# EAGLE design esp8266 lua test (EAGLE 8.5.1)
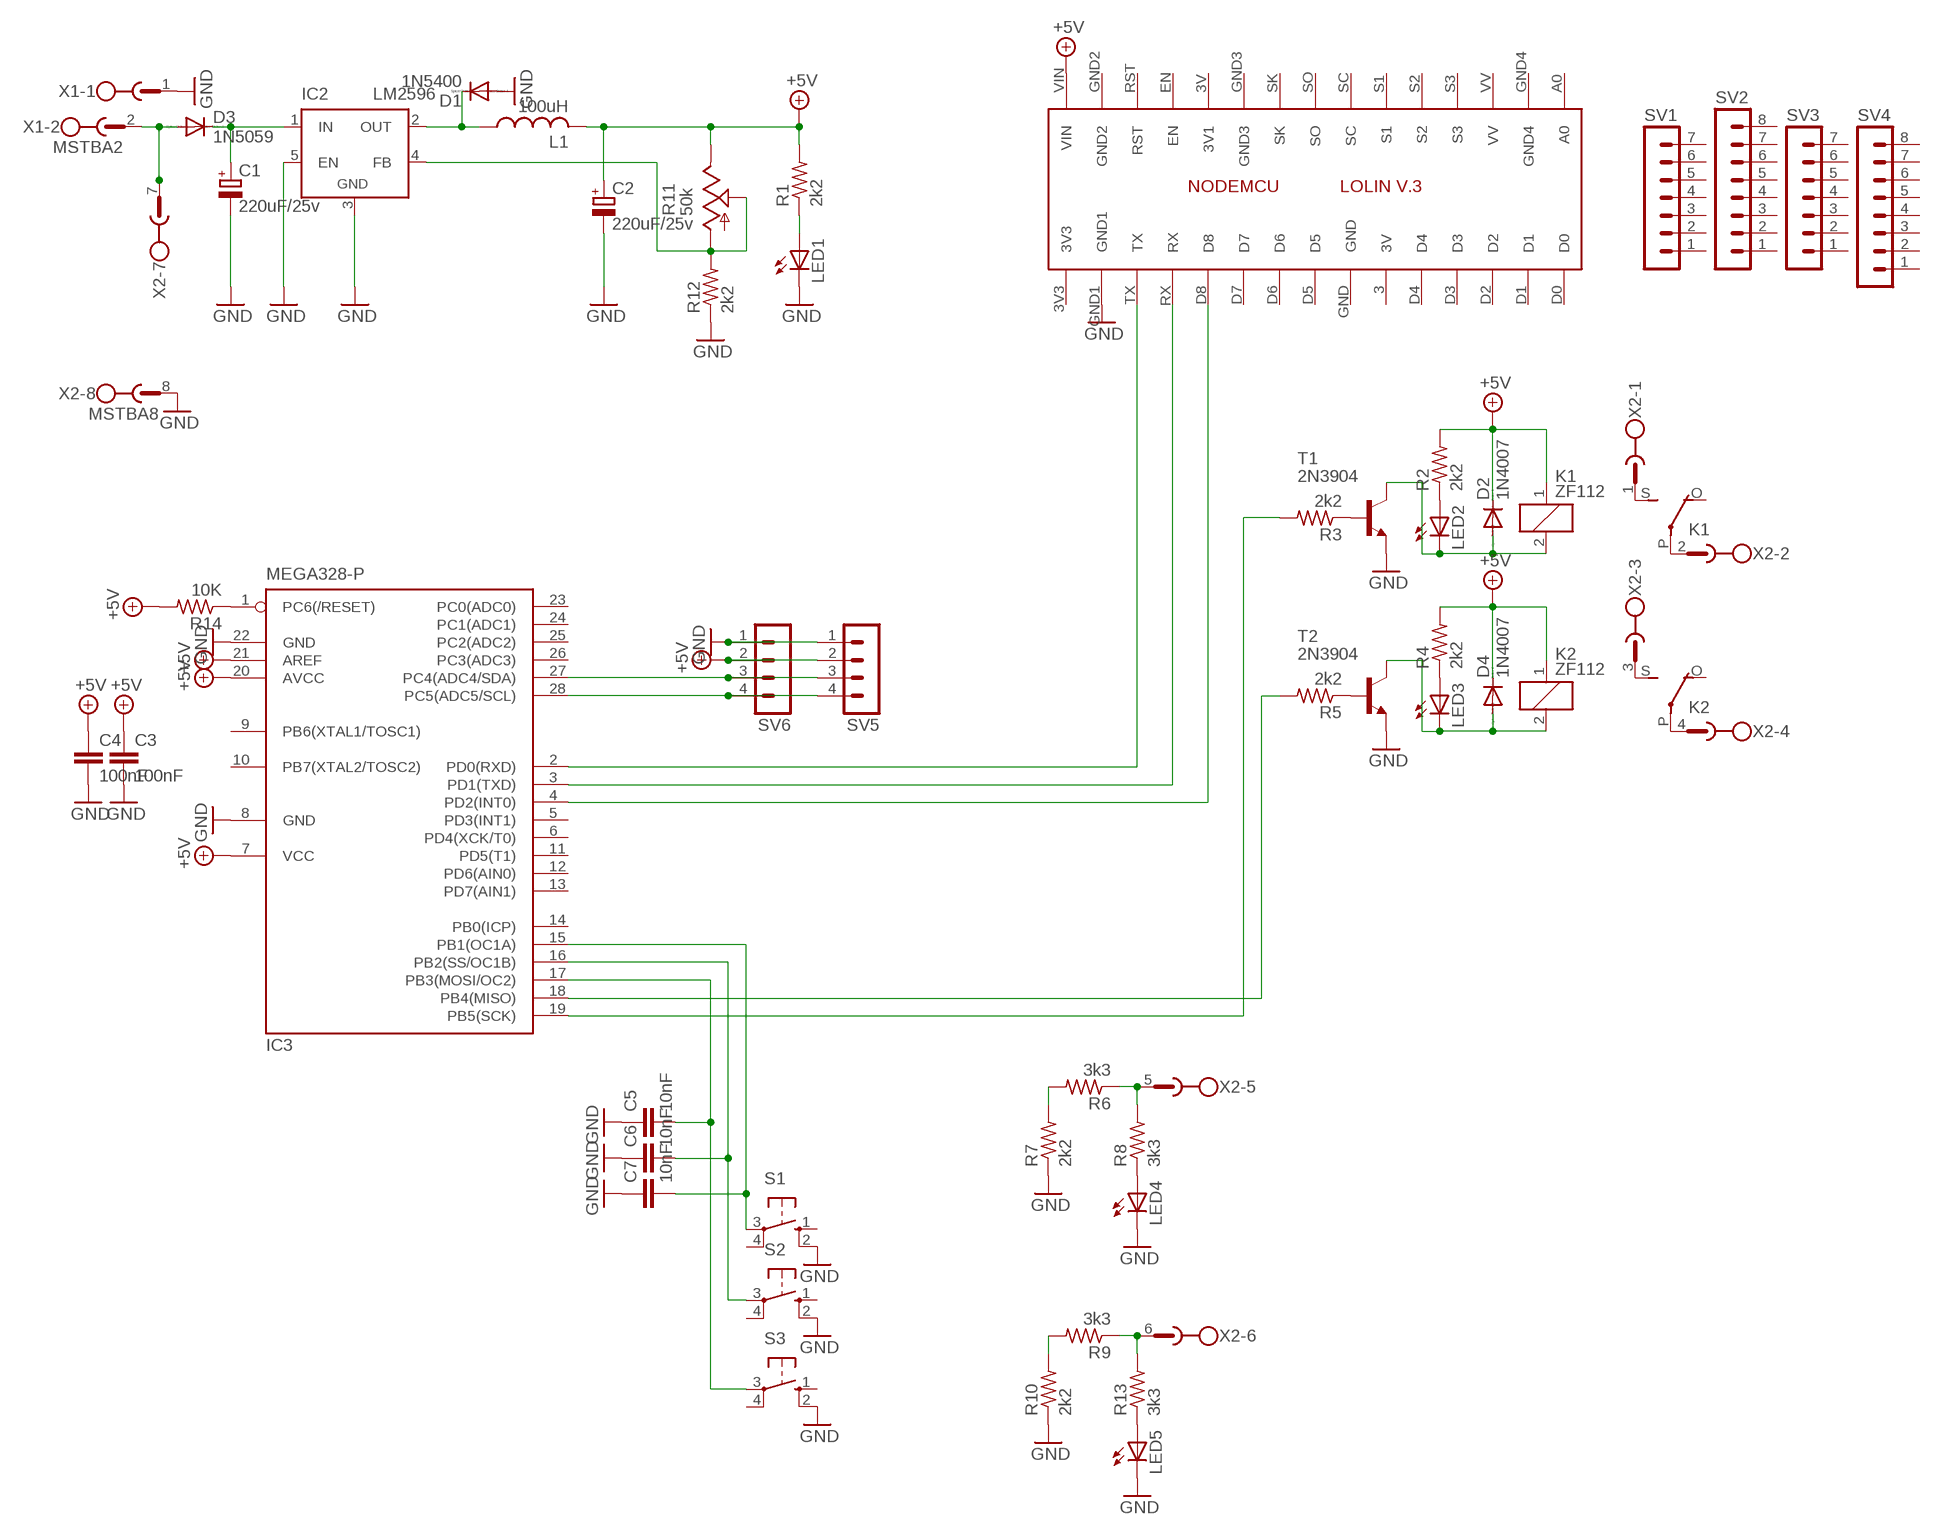
[diagram p0: schematic, sheet 1]

## Parts
C1  220uF/25v  CPOL-EUE3.5-10  [E3,5-10]
C2  220uF/25v  CPOL-EUE3.5-10  [E3,5-10]
C3  100nF  C-EU050-024X044  [C050-024X044]
C4  100nF  C-EU050-024X044  [C050-024X044]
C5  10nF  C-EU050-024X044  [C050-024X044]
C6  10nF  C-EU050-024X044  [C050-024X044]
C7  10nF  C-EU050-024X044  [C050-024X044]
D1  1N5400  [DO201-15]
D2  1N4007  1N4148DO35-7  [DO35-7]
D3  1N5059  [DO204-10]
D4  1N4007  1N4148DO35-7  [DO35-7]
IC1  LOLINV3  [LOLINV3]
IC2  LM2596  LM2596TV  [TO220-51]
IC3  MEGA328-P  MEGA8-P  [DIL28-3]
K1  ZF112  [ZF112]
K2  ZF112  [ZF112]
L1  100uH  L-US6000-XXX-RC  [6000-XXXX-RC]
LED1  LED3MM  [LED3MM]
LED2  LED3MM  [LED3MM]
LED3  LED3MM  [LED3MM]
LED4  LED3MM  [LED3MM]
LED5  LED3MM  [LED3MM]
R1  2k2  R-US_0207/10  [0207/10]
R2  2k2  R-US_0207/10  [0207/10]
R3  2k2  R-US_0207/10  [0207/10]
R4  2k2  R-US_0207/10  [0207/10]
R5  2k2  R-US_0207/10  [0207/10]
R6  3k3  R-US_0207/10  [0207/10]
R7  2k2  R-US_0207/10  [0207/10]
R8  3k3  R-US_0207/10  [0207/10]
R9  3k3  R-US_0207/10  [0207/10]
R10  2k2  R-US_0207/10  [0207/10]
R11  50k  TRIM_US-B25P  [B25P]
R12  2k2  R-US_0207/10  [0207/10]
R13  3k3  R-US_0207/10  [0207/10]
R14  10K  R-US_0207/10  [0207/10]
S1  10-XX  [B3F-10XX]
S2  10-XX  [B3F-10XX]
S3  10-XX  [B3F-10XX]
SV1  MA07-1  [MA07-1]
SV2  MA08-1  [MA08-1]
SV3  MA07-1  [MA07-1]
SV4  MA08-1  [MA08-1]
SV5  MA04-1  [MA04-1]
SV6  MA04-1  [MA04-1]
T1  2N3904  2N3904-NPN-TO92-EBC  [TO92-EBC]
T2  2N3904  2N3904-NPN-TO92-EBC  [TO92-EBC]
X1  MSTBA2  [MSTBA2]
X2  MSTBA8  [MSTBA8]

## Nets
+5V: C2.+ C3.1 C4.1 D2.C D4.C IC1.VIN IC3.7(VCC) IC3.20(AVCC) IC3.21(AREF) K1.1 K2.1 L1.2 R1.2 R2.2 R4.2 R11.E R14.2 SV5.2 SV6.2
GND: C1.- C2.- C3.2 C4.2 C5.1 C6.1 C7.1 D1.A IC1.GND1 IC2.3(GND) IC2.5(EN) IC3.8(GND) IC3.22(GND) LED1.K(C) LED4.K(C) LED5.K(C) R7.1 R10.1 R12.1 S1.2(S1) S2.2(S1) S3.2(S1) SV5.1 SV6.1 T1.E T2.E X1.1 X2.8
N$1: LED1.A R1.1
N$2: C1.+ D3.C IC2.1(IN)
N$3: D1.C IC2.2(OUT) L1.1
N$4: LED2.A R2.1
N$5: D2.A K1.2 LED2.K(C) T1.C
N$7: K1.S(2:S) X2.1
N$8: R3.1 T1.B
N$9: LED3.A R4.1
N$10: D4.A K2.2 LED3.K(C) T2.C
N$11: R5.1 T2.B
N$12: LED4.A R8.1
N$13: R6.1 R8.2 X2.5
N$14: R6.2 R7.2
N$15: LED5.A R13.1
N$16: R9.1 R13.2 X2.6
N$17: R9.2 R10.2
N$18: K1.P(2:P) X2.2
N$19: K2.S(2:S) X2.3
N$20: K2.P(2:P) X2.4
N$21: IC3.1(PC6(/RESET)) R14.1
N$22: IC3.19(PB5(SCK)) R3.2
N$23: IC3.18(PB4(MISO)) R5.2
N$24: C7.2 IC3.15(PB1(OC1A)) S1.3(P)
N$25: C6.2 IC3.16(PB2(SS/OC1B)) S2.3(P)
N$26: C5.2 IC3.17(PB3(MOSI/OC2)) S3.3(P)
N$27: IC1.TX IC3.2(PD0(RXD))
N$28: IC1.RX IC3.3(PD1(TXD))
N$29: IC1.D8 IC3.4(PD2(INT0))
N$30: IC3.27(PC4(ADC4/SDA)) SV5.3 SV6.3
N$31: IC3.28(PC5(ADC5/SCL)) SV5.4 SV6.4
N$32: D3.A X1.2 X2.7
N$42: IC2.4(FB) R11.A R11.S R12.2
Unconnected: IC1.3(3V) IC1.3V3 IC1.3V(3V1) IC1.A0 IC1.D0 IC1.D1 IC1.D2 IC1.D3 IC1.D4 IC1.D5 IC1.D6 IC1.D7 IC1.EN IC1.GND IC1.GND2 IC1.GND3 IC1.GND4 IC1.RST IC1.S1 IC1.S2 IC1.S3 IC1.SC IC1.SK IC1.SO IC1.VV IC3.5(PD3(INT1)) IC3.6(PD4(XCK/T0)) IC3.9(PB6(XTAL1/TOSC1)) IC3.10(PB7(XTAL2/TOSC2)) IC3.11(PD5(T1)) IC3.12(PD6(AIN0)) IC3.13(PD7(AIN1)) IC3.14(PB0(ICP)) IC3.23(PC0(ADC0)) IC3.24(PC1(ADC1)) IC3.25(PC2(ADC2)) IC3.26(PC3(ADC3)) K1.O(2:O) K2.O(2:O) S1.1(S) S1.4(P1) S2.1(S) S2.4(P1) S3.1(S) S3.4(P1) SV1.1 SV1.2 SV1.3 SV1.4 SV1.5 SV1.6 SV1.7 SV2.1 SV2.2 SV2.3 SV2.4 SV2.5 SV2.6 SV2.7 SV2.8 SV3.1 SV3.2 SV3.3 SV3.4 SV3.5 SV3.6 SV3.7 SV4.1 SV4.2 SV4.3 SV4.4 SV4.5 SV4.6 SV4.7 SV4.8

## Library data of the parts
C1 C2 = rcl:CPOL-EU: POLARIZED CAPACITOR, European symbol; SPICEPREFIX: C
C3-C7 = rcl:C-EU: CAPACITOR, European symbol; SPICEPREFIX: C
D1 = diode:1N5400: DIODE standard rectifier, 3 A, 50 V (Motorola)
D2 D4 = diode:1N4148: DIODE high speed (Philips)
D3 = diode:1N5059: DIODE controlled avalanche rectifier
IC1 = Lolin:LOLINV3
IC2 = linear:LM2596T: STEP-DOWN VOLTAGE REGULATOR
IC3 = atmel:MEGA8-P: MICROCONTROLLER 8 Kbytes FLASH, 1 kbytes SRAM, 512 bytes EEPROM, USART, 4-channel 10 bit ADC, 2-channel 8 bit ADC Pin compatible with Atmega48, ATMega88, ATMega168 Source: avr.lbr; OC_FARNELL: unknown; OC_NEWARK: unknown
K1 K2 = relay:ZF112: RELAY 1 x switch; OC_FARNELL: unknown; OC_NEWARK: unknown
L1 = rcl:L-US: INDUCTOR, American symbol; SPICEPREFIX: L
LED1-LED5 = led:LED: LED OSRAM: - CHIPLED LG R971, LG N971, LY N971, LG Q971, LY Q971, LO R971, LY R971 LH N974, LH R974 LS Q976, LO Q976, LY Q976 LO Q996 - Hyper CHIPLED LW Q18S LB Q993, LB Q99A, LB R99A - SideLED LS A670, LO A670, LY A670, LG A670, LP A670 LB A673, LV A673, LT A673, LW A673 LH A674 LY A675 LS A676, LA A676, LO A676, LY A676, LW A676 LS A679, LY A679, LG A679 - Hyper Micro SIDELED® LS Y876, LA Y876, LO Y876, LY Y876 LT Y87S - SmartLED LW L88C, LW L88S LB L89C, LB L89S, LG L890 LS L89K, LO L89K, LY L89K LS L896, LA L896, LO L896, LY L896 - TOPLED LS T670, LO T670, LY T670, LG T670, LP T670 LSG T670, LSP T670, LSY T670, LOP T670, LYG T670 LG T671, LOG T671, LSG T671 LB T673, LV T673, LT T673, LW T673 LH T674 LS T676, LA T676, LO T676, LY T676, LB T676, LH T676, LSB T676, LW T676 LB T67C, LV T67C, LT T67C, LS T67K, LO T67K, LY T67K, LW E67C LS E67B, LA E67B, LO E67B, LY E67B, LB E67C, LV E67C, LT E67C LW T67C LS T679, LY T679, LG T679 LS T770, LO T770, LY T770, LG T770, LP T770 LB T773, LV T773, LT T773, LW T773 LH T774 LS E675, LA E675, LY E675, LS T675 LS T776, LA T776, LO T776, LY T776, LB T776 LHGB T686 LT T68C, LB T68C - Hyper Mini TOPLED® LB M676 - Mini TOPLED Santana® LG M470 LS M47K, LO M47K, LY M47K Source: http://www.osram.convergy.de LUXEON: - LUMILED® LXK2-PW12-R00, LXK2-PW12-S00, LXK2-PW14-U00, LXK2-PW14-V00 LXK2-PM12-R00, LXK2-PM12-S00, LXK2-PM14-U00 LXK2-PE12-Q00, LXK2-PE12-R00, LXK2-PE12-S00, LXK2-PE14-T00, LXK2-PE14-U00 LXK2-PB12-K00, LXK2-PB12-L00, LXK2-PB12-M00, LXK2-PB14-N00, LXK2-PB14-P00, LXK2-PB14-Q00 LXK2-PR12-L00, LXK2-PR12-M00, LXK2-PR14-Q00, LXK2-PR14-R00 LXK2-PD12-Q00, LXK2-PD12-R00, LXK2-PD12-S00 LXK2-PH12-R00, LXK2-PH12-S00 LXK2-PL12-P00, LXK2-PL12-Q00, LXK2-PL12-R00 Source: www.luxeon.com KINGBRIGHT: KA-3528ASYC Source: www.kingbright.com
R1-R10 R12-R14 = rcl:R-US_: RESISTOR, American symbol; SPICEPREFIX: R
R11 = pot:TRIM_US-: POTENTIOMETER
S1-S3 = switch-omron:10-XX: OMRON SWITCH; MPN: B3F-1000; OC_FARNELL: 176432; OC_NEWARK: 36M3542
SV1 SV3 = con-lstb:MA07-1: PIN HEADER; OC_FARNELL: unknown; OC_NEWARK: unknown
SV2 SV4 = con-lstb:MA08-1: PIN HEADER; OC_FARNELL: unknown; OC_NEWARK: unknown
SV5 SV6 = con-lstb:MA04-1: PIN HEADER; OC_FARNELL: unknown; OC_NEWARK: unknown
T1 T2 = transistor-neu-to92:*-NPN-: NPN Transistror
X1 = con-phoenix-508:MSTBA2: PHOENIX; MF: FARNELL; MPN: 1757242; OC_FARNELL: 3705171; OC_NEWARK: 71C4161
X2 = con-phoenix-508:MSTBA8: PHOENIX; MF: FARNELL; MPN: 1757307; OC_FARNELL: 3705225; OC_NEWARK: 71C4166

## Board
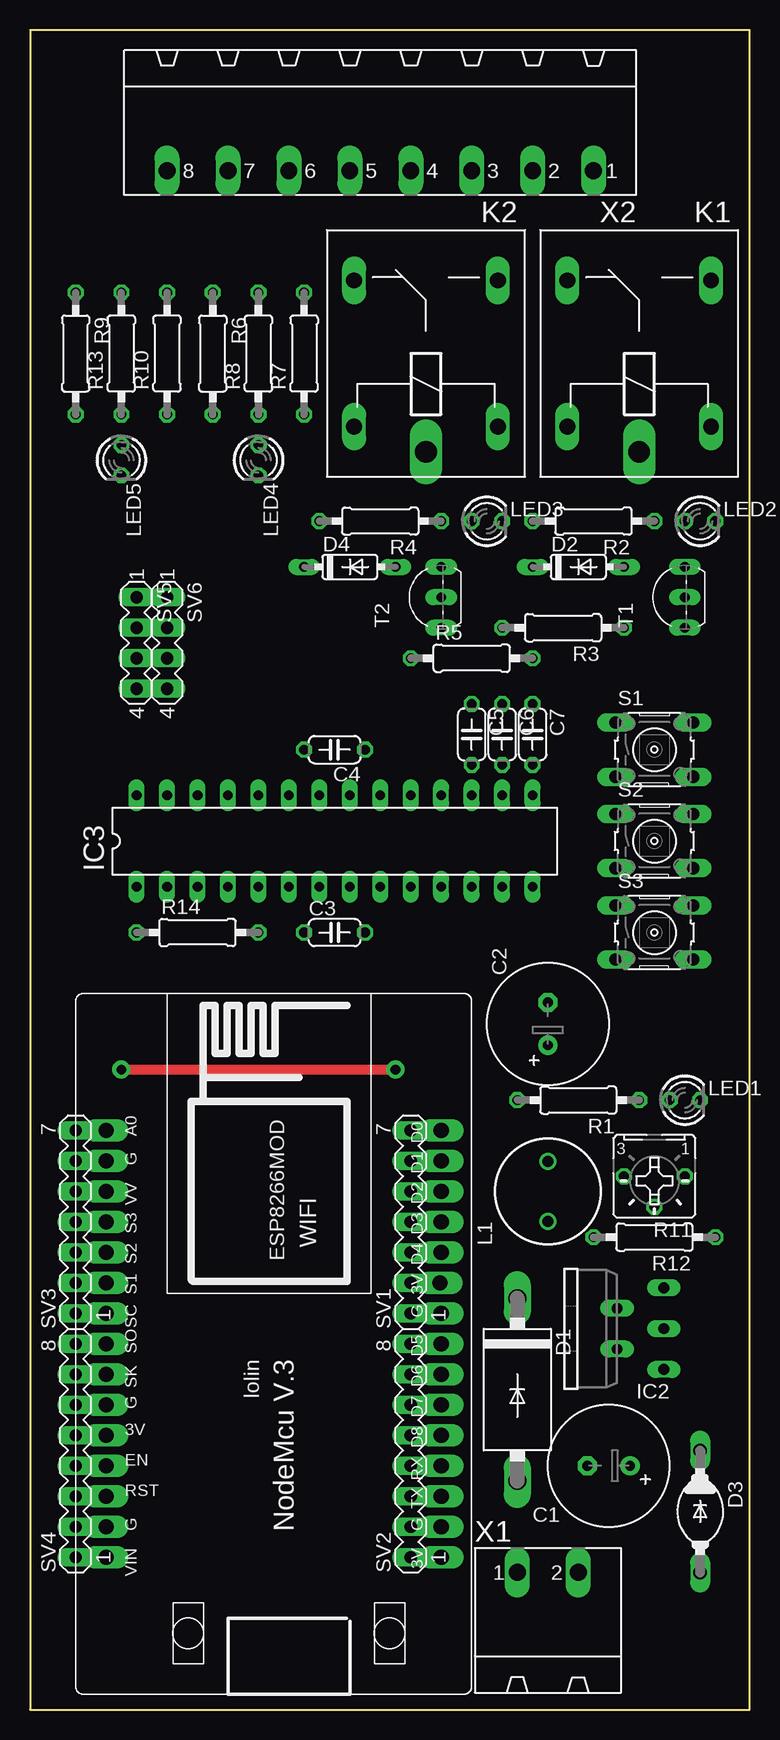
[diagram p1: board, top side]
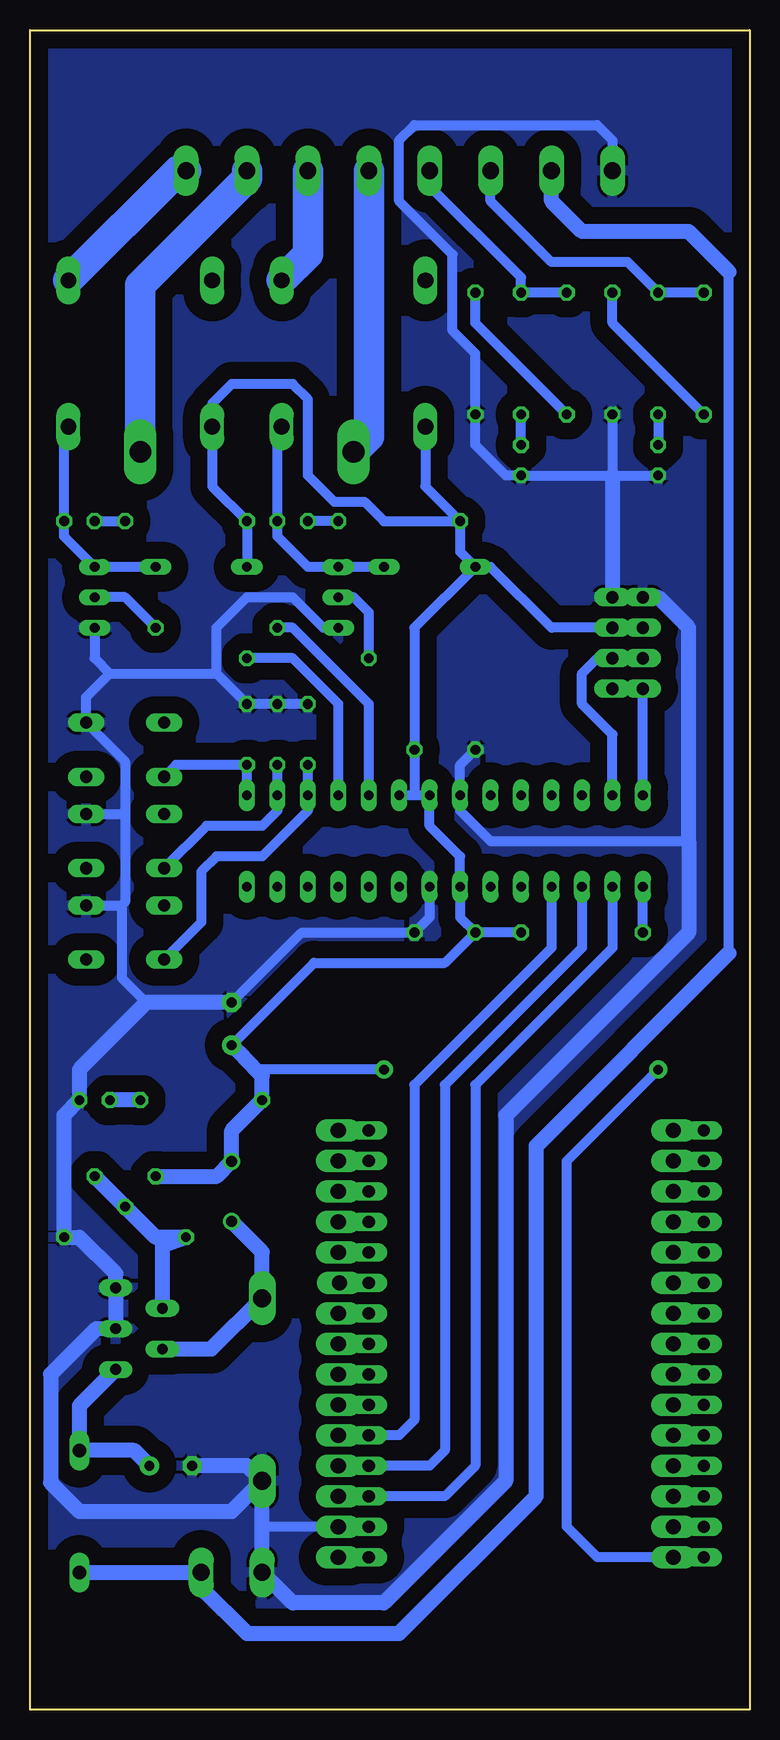
[diagram p2: board, bottom side, seen from below]

Size 60 x 140 mm. Coordinates in mm from the lower left corner, seen from the top.
Outline: 0,0 60,0 60,140 0,140 0,0
Copper layers (1*16): Top 0.035mm / dielectric 1.5mm / Bottom 0.035mm
Design rules "default *": minimum track width 6mil, minimum drill 0.35mm, track to track 6mil, track to pad 6mil, pad to pad 6mil, via to via 6mil, smd to smd 6mil, copper to edge 20mil, drill to drill 6mil, minimum pad ring 10mil, minimum via ring 8mil, stop-mask expansion 4mil, vias tented up to drill 0mil, thermal gap 10mil

### Footprints (pad centres in the part's own frame; a part is rotated, then mirrored left to right if it is on the bottom)
E3,5-10 = drill 0.813 pad 1.6: + -1.778,0 | drill 0.813 pad 1.6 octagon: - 1.778,0
C050-024X044 = drill 0.813 octagon: 1 -2.54,0; 2 2.54,0
DO201-15 = drill 1.499 long: A 7.62,0; C -7.62,0
DO35-7 = drill 0.813 long: A 3.81,0; C -3.81,0
DO204-10 = drill 1.118 long: A 5.08,0; C -5.08,0
LOLINV3 = drill 1.254 pad 1.778 long: 3 -3.81,13.87; 3V 19.05,13.97; 3V3 8.89,-13.97; A0 -16.51,-13.97; D0 -16.51,13.97; D1 -13.97,13.97; D2 -11.43,13.97; D3 -8.89,13.97; D4 -6.35,13.97; D5 1.27,13.97; D6 3.81,13.97; D7 6.35,13.97; D8 8.89,13.97; EN 11.43,-13.97; GND -1.27,13.97; GND1 16.51,13.97; GND2 16.51,-13.97; GND3 6.35,-13.97; GND4 -13.97,-13.97; RST 13.97,-13.97; RX 11.43,13.97; S1 -3.81,-13.97; S2 -6.35,-13.97; S3 -8.89,-13.97; SC -1.27,-13.97; SK 3.81,-13.97; SO 1.27,-13.97; TX 13.97,13.97; VIN 19.05,-13.97; VV -11.43,-13.97
TO220-51 = drill 0.9 long: 1 -3.4,-8.4; 2 -1.7,-4.5; 3 0,-8.4; 4 1.7,-4.5; 5 3.4,-8.4
DIL28-3 = drill 0.813 long: 1 -16.51,-3.81; 2 -13.97,-3.81; 3 -11.43,-3.81; 4 -8.89,-3.81; 5 -6.35,-3.81; 6 -3.81,-3.81; 7 -1.27,-3.81; 8 1.27,-3.81; 9 3.81,-3.81; 10 6.35,-3.81; 11 8.89,-3.81; 12 11.43,-3.81; 13 13.97,-3.81; 14 16.51,-3.81; 15 16.51,3.81; 16 13.97,3.81; 17 11.43,3.81; 18 8.89,3.81; 19 6.35,3.81; 20 3.81,3.81; 21 1.27,3.81; 22 -1.27,3.81; 23 -3.81,3.81; 24 -6.35,3.81; 25 -8.89,3.81; 26 -11.43,3.81; 27 -13.97,3.81; 28 -16.51,3.81
ZF112 = drill 1.321 long: 1 -6.096,5.994; 2 -6.096,-5.994; O 6.096,5.994; S 6.096,-5.994 | drill 1.803 long: P -8.204,0
6000-XXXX-RC = drill 0.9 pad 1.422: 1 -2.5,0; 2 2.5,0
LED3MM = drill 0.813 octagon: A -1.27,0; K 1.27,0
0207/10 = drill 0.813 octagon: 1 -5.08,0; 2 5.08,0
B25P = drill 0.813 octagon: A -2.54,0; E 2.54,0; S 0,2.54
B3F-10XX = drill 1.016 long: 1 -3.251,2.261; 2 3.251,2.261; 3 -3.251,-2.261; 4 3.251,-2.261
MA07-1 = drill 1.016 long: 1 -7.62,0; 2 -5.08,0; 3 -2.54,0; 4 0,0; 5 2.54,0; 6 5.08,0; 7 7.62,0
MA08-1 = drill 1.016 long: 1 -8.89,0; 2 -6.35,0; 3 -3.81,0; 4 -1.27,0; 5 1.27,0; 6 3.81,0; 7 6.35,0; 8 8.89,0
MA04-1 = drill 1.016 long: 1 -3.81,0; 2 -1.27,0; 3 1.27,0; 4 3.81,0
TO92-EBC = drill 0.813 long: B 0,-1.27; C 2.54,-1.27; E -2.54,-1.27
MSTBA2 = drill 1.397 long: 1 -2.54,5.08; 2 2.54,5.08
MSTBA8 = drill 1.397 long: 1 -17.78,5.08; 2 -12.7,5.08; 3 -7.62,5.08; 4 -2.54,5.08; 5 2.54,5.08; 6 7.62,5.08; 7 12.7,5.08; 8 17.78,5.08

### Placement (x,y rotation side)
C1  48.26,20.32 180 top
C2  43.18,57.15 90 top
C3  25.4,64.77 0 top
C4  25.4,80.01 180 top
C5  36.83,81.28 270 top
C6  39.37,81.28 270 top
C7  41.91,81.28 270 top
D1  40.64,26.67 270 top
D2  45.72,95.25 0 top
D3  55.88,16.51 270 top
D4  26.67,95.25 0 top
IC1  20.32,31.75 270 top
IC2  44.45,31.75 90 top
IC3  25.4,72.39 0 top
K1  50.8,113.03 90 top
K2  33.02,113.03 90 top
L1  43.18,43.18 90 top
LED1  54.61,50.8 0 top
LED2  55.88,99.06 0 top
LED3  38.1,99.06 0 top
LED4  19.05,104.14 270 top
LED5  7.62,104.14 270 top
R1  45.72,50.8 180 top
R2  46.99,99.06 180 top
R3  44.45,90.17 180 top
R4  29.21,99.06 180 top
R5  36.83,87.63 0 top
R6  15.24,113.03 270 top
R7  22.86,113.03 90 top
R8  19.05,113.03 90 top
R9  3.81,113.03 270 top
R10  11.43,113.03 90 top
R11  52.07,44.45 180 top
R12  52.07,39.37 180 top
R13  7.62,113.03 90 top
R14  13.97,64.77 0 top
S1  52.07,80.01 0 top
S2  52.07,72.39 0 top
S3  52.07,64.77 0 top
SV1  31.75,40.64 90 top
SV2  31.75,21.59 90 top
SV3  3.81,40.64 90 top
SV4  3.81,21.59 90 top
SV5  8.89,88.9 270 top
SV6  11.43,88.9 270 top
T1  53.34,92.71 90 top
T2  33.02,92.71 90 top
X1  43.18,6.35 0 top
X2  29.21,133.35 180 top

### Tracks (layer width: path | path; a pad name or v marks a point on that pad's centre or on a via)
+5V  (via drill 0.8 pad 1.5)
  Top 0.813: v7.62,53.34 v30.48,53.34
  Bottom 0.813: 27.94,76.2 IC3.21 26.67,73.66 24.13,71.12 IC3.7 24.13,66.04 C3.1 | 27.94,76.2 IC3.20 | 27.94,76.2 C4.1 27.94,90.17 D4.C | R14.2 C3.1 | D2.C R2.2 44.81,101.96 K1.1 44.81,108.86 43.18,110.49 38.1,110.49 36.83,109.22 36.83,102.87 34.65,100.69 32.11,100.69 30.48,99.06 R4.2 | K2.1 27.03,101.96 R4.2 | C3.1 25.4,62.23 36.32,62.23 C2.+ | D4.C 21.59,95.25 16.51,90.17 SV6.2 SV5.2 | R4.2 24.13,96.52 D4.C | IC1.VIN 12.7,12.7 15.24,15.24 15.24,45.72 v7.62,53.34 | v30.48,53.34 41.15,53.34 42.16,54.36
  Bottom 1.27: R11.E 44.41,44.45 L1.2 43.18,48.26 R1.2 40.64,52.83 42.16,54.36 C2.+
GND
  Bottom 0.813: IC3.8 26.67,66.04 C3.2 37.34,64.77 C2.- | C4.2 24.13,78.74 IC3.22 24.13,74.93 21.59,72.39 5.08,72.39 | 11.43,102.87 LED4.K 20.32,102.87 22.86,105.41 R7.1 22.86,113.03 24.77,114.94 24.77,121.28 29.21,125.73 29.21,130.81 27.94,132.08 12.7,132.08 11.43,130.81 X2.8 | 11.43,102.87 LED5.K | C5.1 C6.1 C7.1 44.45,86.36 | 53.34,86.36 55.32,84.38 S1.2 52.07,79.02 52.07,74.93 | 53.34,86.36 44.45,86.36 | 52.07,74.93 52.07,67.31 52.35,67.03 | S3.2 52.35,67.03 | S2.2 52.35,74.65 52.07,74.93 | 52.35,67.03 52.35,60.98 50.29,58.93 | R10.1 11.43,102.87 | SV6.1 SV5.1 | IC1.GND1 40.64,15.24 | T2.E 35.56,90.17 38.1,92.71 41.91,92.71 44.45,90.17 44.45,86.36 | T1.E 54.61,87.63 53.34,86.36
  Bottom 1.27: D1.A 40.64,15.24 X1.1 38.1,8.89 30.48,8.89 20.32,19.05 20.32,49.53 5.08,64.77 5.08,72.39 5.08,90.17 7.62,92.71 SV5.1 | D1.A 41.91,20.32 C1.- | D1.A 43.18,16.51 55.88,16.51 58.27,18.9 58.27,27.94 54.46,31.75 IC2.3 IC2.5 52.85,36.34 55.88,39.37 R12.1 57.15,49.53 LED1.K 55.88,53.34 50.29,58.93 C2.- | 11.43,102.87 SV6.1
  pour Bottom (isolate 1.422): 0,139.7 59.69,139.7 59.69,0 0,0
N$1
  Bottom 1.27: R1.1 LED1.A
N$2
  Bottom 1.27: IC2.1 55.88,25.32 D3.C 51.31,21.59 C1.+
N$3
  Bottom 1.27: IC2.2 44.88,30.05 D1.C 40.64,38.14 L1.1
N$4
  Bottom 0.813: LED2.A R2.1
N$5
  Bottom 0.813: K1.2 57.15,106.58 LED2.K 57.15,97.79 T1.C D2.A
N$7
  Bottom 2.54: X2.1 47.65,128.27 K1.S
N$8
  Bottom 0.813: R3.1 52.07,92.71 T1.B
N$9
  Bottom 0.813: R4.1 LED3.A
N$10
  Bottom 0.813: K2.2 39.37,106.58 LED3.K 39.37,97.79 36.83,95.25 T2.C D4.A
N$11
  Bottom 0.813: R5.1 31.75,91.44 33.02,92.71 T2.B
N$12
  Bottom 0.813: LED4.A R8.1
N$13
  Bottom 0.813: R6.1 R8.2 19.05,119.38 26.67,127 X2.5
N$14
  Bottom 0.813: R6.2 22.86,115.57 R7.2
N$15
  Bottom 0.813: R13.1 LED5.A
N$16
  Bottom 0.813: R9.1 R13.2 10.16,120.65 16.51,120.65 21.59,125.73 X2.6
N$17
  Bottom 0.813: R9.2 11.43,115.57 R10.2
N$18
  Bottom 2.54: X2.2 41.91,127.64 50.8,118.75 K1.P
N$19
  Bottom 2.54: X2.3 36.83,121.31 K2.S
N$20
  Bottom 2.54: K2.P 31.75,106.1 X2.4
N$21
  Bottom 0.813: R14.1 IC3.1
N$22
  Bottom 0.813: IC3.19 31.75,83.82 38.1,90.17 R3.2
N$23
  Bottom 0.813: IC3.18 34.29,83.82 38.1,87.63 R5.2
N$24
  Bottom 0.813: IC3.15 C7.2 47.83,78.74 S1.3
N$25
  Bottom 0.813: C6.2 IC3.16 39.37,74.93 40.64,73.66 45.29,73.66 S2.3
N$26
  Bottom 0.813: C5.2 IC3.17 36.83,74.93 40.64,71.12 44.45,71.12 45.72,69.85 45.72,65.61 S3.3
N$27
  Bottom 0.813: IC1.TX 25.4,17.78 22.86,20.32 22.86,52.07 11.43,63.5 IC3.2
N$28
  Bottom 0.813: IC1.RX 26.67,20.32 25.4,21.59 25.4,52.07 13.97,63.5 IC3.3
N$29
  Bottom 0.813: IC1.D8 29.21,22.86 27.94,24.13 27.94,52.07 16.51,63.5 IC3.4
N$30
  Bottom 0.813: IC3.27 11.43,81.28 13.97,83.82 13.97,86.36 12.7,87.63 SV6.3 SV5.3
N$31
  Bottom 0.813: IC3.28 SV5.4 SV6.4
N$32
  Bottom 0.813: 1.73,63.04 1.73,119.84
  Bottom 1.27: D3.A X1.2 45.72,10.16 41.91,6.35 29.21,6.35 17.78,17.78 17.78,46.99 1.73,63.04 | X2.7 16.51,125.73 13.97,123.19 5.08,123.19 1.73,119.84
N$42
  Bottom 1.27: IC2.4 48.95,38.68 R12.2 49.53,39.37 R11.S R11.A